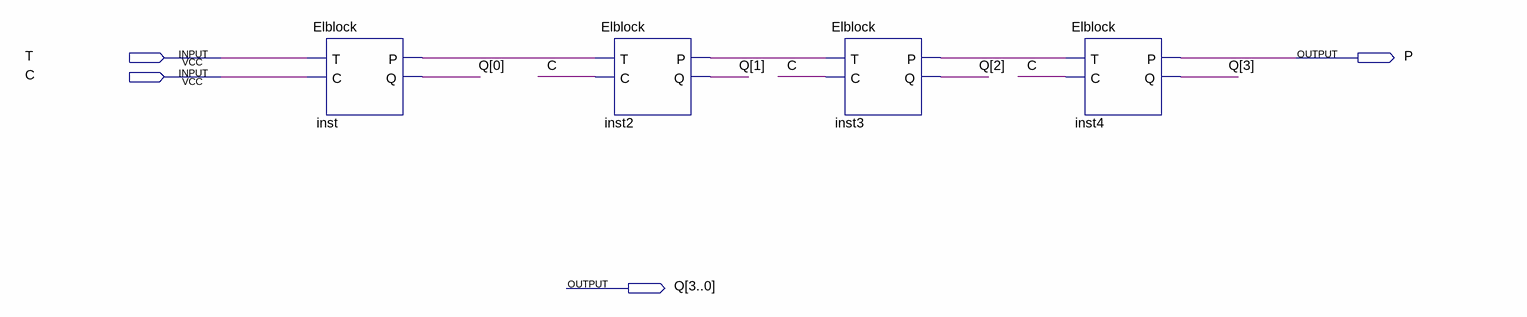
[diagram p0: schematic sheet]
// Quartus schematic Lab9.bdf as structural Verilog: 4 symbols, 4 pins
module Lab9 (
  input  T,
  input  C,
  output P,
  output [3:0] Q
);

  wire inst2_p, inst3_p, inst_p;

  Elblock inst (.T(T), .C(C), .P(inst_p), .Q(Q[0]));
  Elblock inst2 (.T(inst_p), .C(C), .P(inst2_p), .Q(Q[1]));
  Elblock inst3 (.T(inst2_p), .C(C), .P(inst3_p), .Q(Q[2]));
  Elblock inst4 (.T(inst3_p), .C(C), .P(P), .Q(Q[3]));
endmodule
